# EAGLE schematic lupa-breakout (EAGLE 8.3.1)
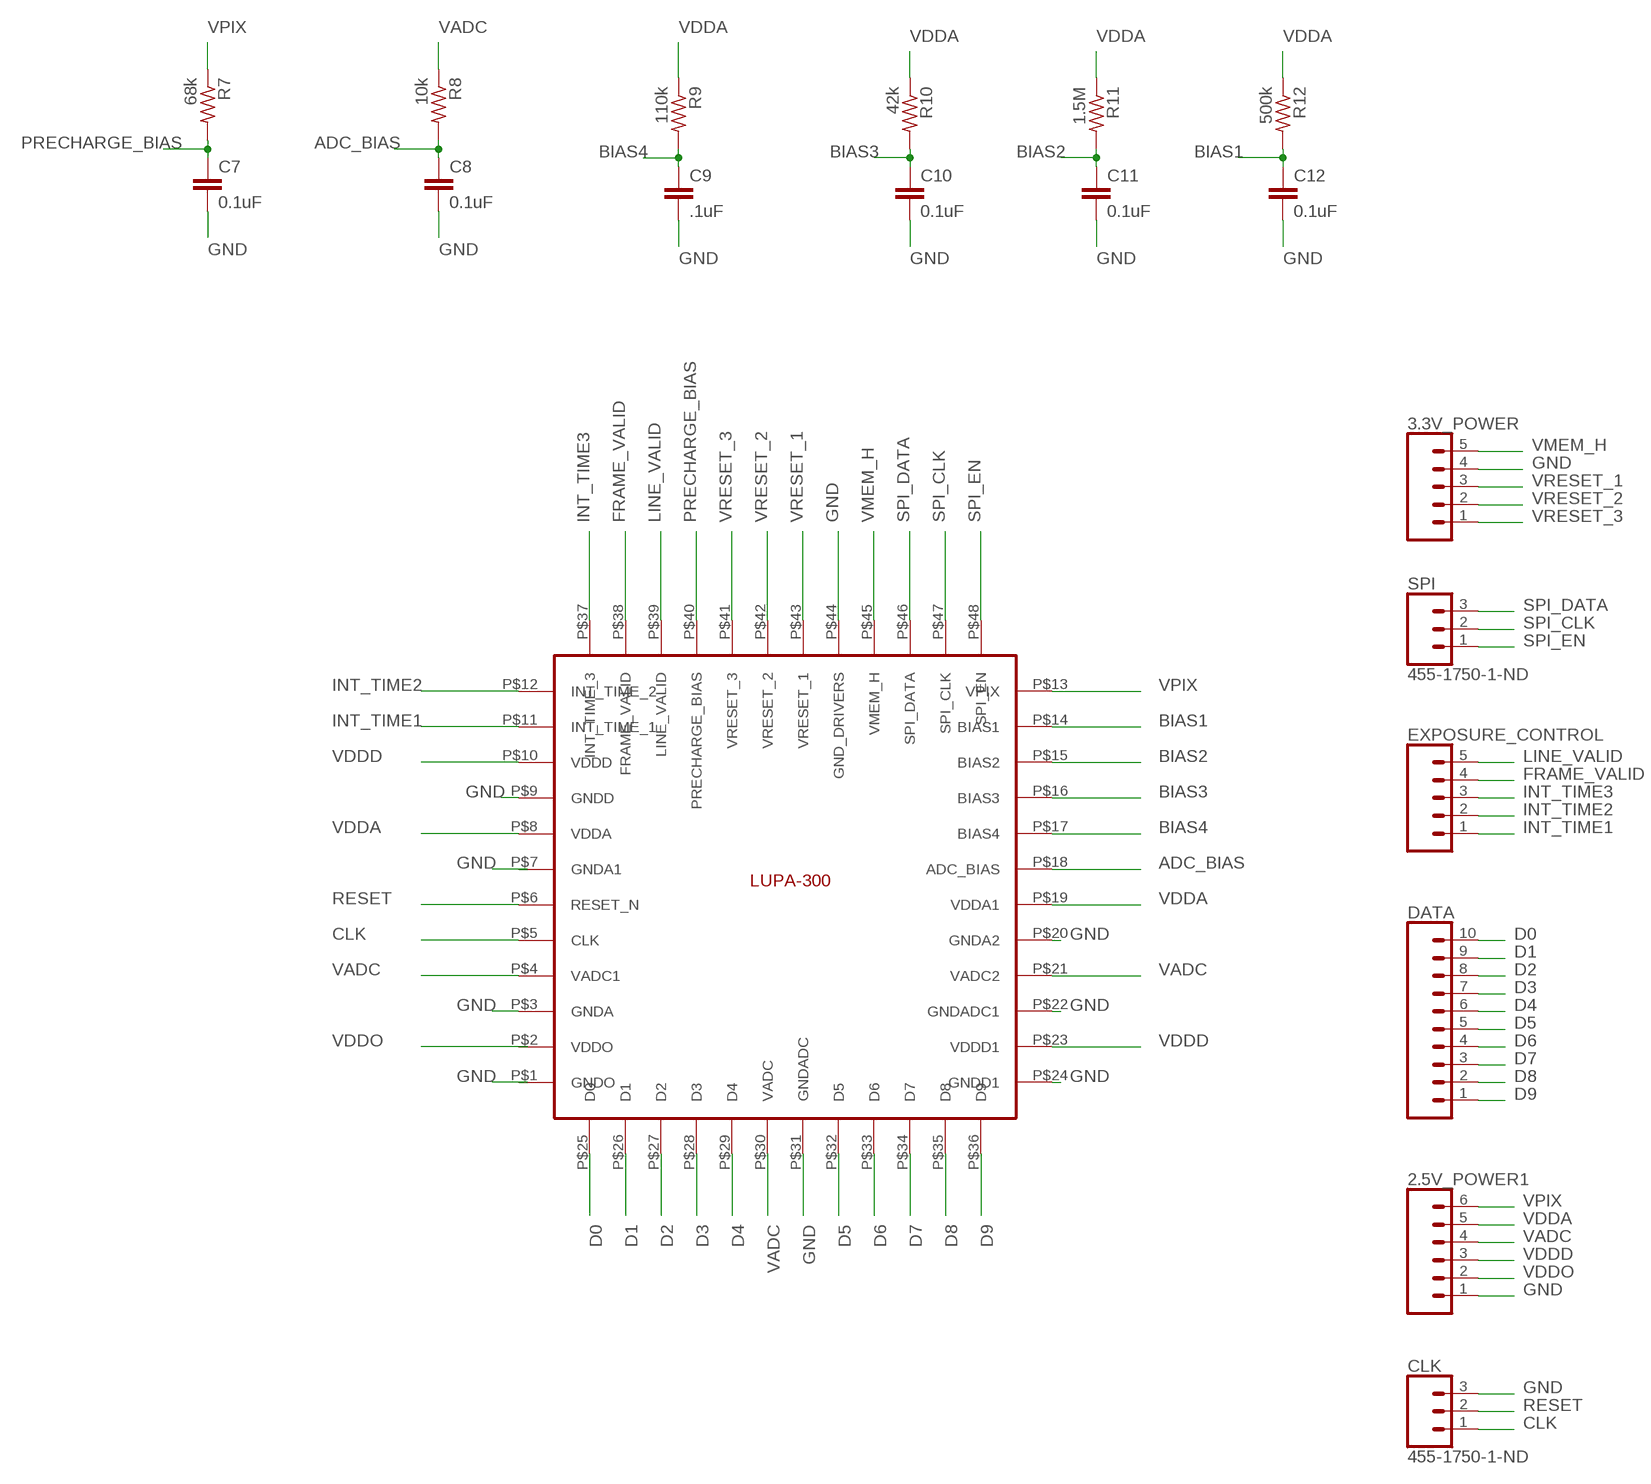
[diagram p0: schematic, sheet 1]

## Parts
2.5V_POWER1  CONN_06SILK_FEMALE_PTH  [1X06]
3.3V_POWER  CONN_05  [1X05]
C7  0.1uF  C-EUC1206  [C1206]
C8  0.1uF  C-EUC1206  [C1206]
C9  .1uF  C-EUC1206  [C1206]
C10  0.1uF  C-EUC1206  [C1206]
C11  0.1uF  C-EUC1206  [C1206]
C12  0.1uF  C-EUC1206  [C1206]
CLK  455-1750-1-ND  CONN_03  [1X03]
DATA  CONN_10"  [1X10]
EXPOSURE_CONTROL  CONN_05  [1X05]
R7  68k  R-US_M1206  [M1206]
R8  10k  R-US_M1206  [M1206]
R9  110k  R-US_M1206  [M1206]
R10  42k  R-US_M1206  [M1206]
R11  1.5M  R-US_M1206  [M1206]
R12  500k  R-US_M1206  [M1206]
SPI  455-1750-1-ND  CONN_03  [1X03]
U$1  LUPA300  [LUPA300]

## Nets
ADC_BIAS: C8.1 R8.2 U$1.P$18(ADC_BIAS)
BIAS1: C12.1 R12.2 U$1.P$14(BIAS1)
BIAS2: C11.1 R11.2 U$1.P$15(BIAS2)
BIAS3: C10.1 R10.2 U$1.P$16(BIAS3)
BIAS4: C9.1 R9.2 U$1.P$17(BIAS4)
CLK: CLK.1 U$1.P$5(CLK)
D0: DATA.10 U$1.P$25(D0)
D1: DATA.9 U$1.P$26(D1)
D2: DATA.8 U$1.P$27(D2)
D3: DATA.7 U$1.P$28(D3)
D4: DATA.6 U$1.P$29(D4)
D5: DATA.5 U$1.P$32(D5)
D6: DATA.4 U$1.P$33(D6)
D7: DATA.3 U$1.P$34(D7)
D8: DATA.2 U$1.P$35(D8)
D9: DATA.1 U$1.P$36(D9)
FRAME_VALID: EXPOSURE_CONTROL.4 U$1.P$38(FRAME_VALID)
GND: 2.5V_POWER1.1 3.3V_POWER.4 C7.2 C8.2 C9.2 C10.2 C11.2 C12.2 CLK.3 U$1.P$1(GNDO) U$1.P$3(GNDA) U$1.P$9(GNDD) U$1.P$20(GNDA2) U$1.P$22(GNDADC1) U$1.P$24(GNDD1) U$1.P$31(GNDADC) U$1.P$44(GND_DRIVERS)
INT_TIME1: EXPOSURE_CONTROL.1 U$1.P$11(INT_TIME_1)
INT_TIME2: EXPOSURE_CONTROL.2 U$1.P$12(INT_TIME_2)
INT_TIME3: EXPOSURE_CONTROL.3 U$1.P$37(INT_TIME_3)
LINE_VALID: EXPOSURE_CONTROL.5 U$1.P$39(LINE_VALID)
PRECHARGE_BIAS: C7.1 R7.2 U$1.P$40(PRECHARGE_BIAS)
RESET: CLK.2 U$1.P$6(RESET_N)
SPI_CLK: SPI.2 U$1.P$47(SPI_CLK)
SPI_DATA: SPI.3 U$1.P$46(SPI_DATA)
SPI_EN: SPI.1 U$1.P$48(SPI_EN)
VADC: 2.5V_POWER1.4 R8.1 U$1.P$4(VADC1) U$1.P$21(VADC2) U$1.P$30(VADC)
VDDA: 2.5V_POWER1.5 R9.1 R10.1 R11.1 R12.1 U$1.P$8(VDDA) U$1.P$19(VDDA1)
VDDD: 2.5V_POWER1.3 U$1.P$10(VDDD) U$1.P$23(VDDD1)
VDDO: 2.5V_POWER1.2 U$1.P$2(VDDO)
VMEM_H: 3.3V_POWER.5 U$1.P$45(VMEM_H)
VPIX: 2.5V_POWER1.6 R7.1 U$1.P$13(VPIX)
VRESET_1: 3.3V_POWER.3 U$1.P$43(VRESET_1)
VRESET_2: 3.3V_POWER.2 U$1.P$42(VRESET_2)
VRESET_3: 3.3V_POWER.1 U$1.P$41(VRESET_3)
Unconnected: U$1.P$7(GNDA1)

## Library data of the parts
2.5V_POWER1 = SparkFun-Connectors:CONN_06: Multi connection point. Often used as Generic Header-pin footprint for 0.1 inch spaced/style header connections On any of the 0.1 inch spaced packages, you can populate with these: Break Away Headers - Straight <https://www.sparkfun.com/products/116> (PRT-00116) Break Away Male Headers - Right Angle <https://www.sparkfun.com/products/553> (PRT-00553) Female Headers <https://www.sparkfun.com/products/115> (PRT-00115) Break Away Headers - Machine Pin <https://www.sparkfun.com/products/117> (PRT-00117) Break Away Female Headers - Swiss Machine Pin <https://www.sparkfun.com/products/743> (PRT-00743) Arduino Stackable Header - 6 Pin <https://www.sparkfun.com/products/9280> (PRT-09280) For SCREWTERMINALS and SPRING TERMINALS visit here: Screw Terimnals on SparkFun.com <https://www.sparkfun.com/search/results?term=Screw+Terminals> (5mm/3.5mm/2.54mm spacing) This device is also useful as a general connection point to wire up your design to another part of your project. Our various solder wires solder well into these plated through hole pads. Hook-Up Wire - Assortment (Stranded, 22 AWG) <https://www.sparkfun.com/products/11375> (PRT-11375) Hook-Up Wire - Assortment (Solid Core, 22 AWG) <https://www.sparkfun.com/products/11367> (PRT-11367) View the entire wire category on our website here <https://www.sparkfun.com/categories/141>; PROD_ID: CONN-08437
3.3V_POWER EXPOSURE_CONTROL = SparkFun-Connectors:CONN_05: Multi connection point. Often used as Generic Header-pin footprint for 0.1 inch spaced/style header connections On any of the 0.1 inch spaced packages, you can populate with these: Break Away Headers - Straight <https://www.sparkfun.com/products/116> (PRT-00116) Break Away Male Headers - Right Angle <https://www.sparkfun.com/products/553> (PRT-00553) Female Headers <https://www.sparkfun.com/products/115> (PRT-00115) Break Away Headers - Machine Pin <https://www.sparkfun.com/products/117> (PRT-00117) Break Away Female Headers - Swiss Machine Pin <https://www.sparkfun.com/products/743> (PRT-00743) For SCREWTERMINALS and SPRING TERMINALS visit here: Screw Terimnals on SparkFun.com <https://www.sparkfun.com/search/results?term=Screw+Terminals> (5mm/3.5mm/2.54mm spacing) This device is also useful as a general connection point to wire up your design to another part of your project. Our various solder wires solder well into these plated through hole pads. Hook-Up Wire - Assortment (Stranded, 22 AWG) <https://www.sparkfun.com/products/11375> (PRT-11375) Hook-Up Wire - Assortment (Solid Core, 22 AWG) <https://www.sparkfun.com/products/11367> (PRT-11367) View the entire wire category on our website here <https://www.sparkfun.com/categories/141> Special notes: Molex polarized connector foot print use with SKU : PRT-08231 with associated crimp pins and housings. 1MM SMD Version SKU: PRT-10208
C7-C12 = rcl:C-EU: CAPACITOR, European symbol
CLK SPI = SparkFun-Connectors:CONN_03: Multi connection point. Often used as Generic Header-pin footprint for 0.1 inch spaced/style header connections On any of the 0.1 inch spaced packages, you can populate with these: Break Away Headers - Straight <https://www.sparkfun.com/products/116> (PRT-00116) Break Away Male Headers - Right Angle <https://www.sparkfun.com/products/553> (PRT-00553) Female Headers <https://www.sparkfun.com/products/115> (PRT-00115) Break Away Headers - Machine Pin <https://www.sparkfun.com/products/117> (PRT-00117) Break Away Female Headers - Swiss Machine Pin <https://www.sparkfun.com/products/743> (PRT-00743) Stackable Header - 3 Pin (Female, 0.1") <https://www.sparkfun.com/products/13875> (PRT-13875) For SCREWTERMINALS and SPRING TERMINALS visit here: Screw Terimnals on SparkFun.com <https://www.sparkfun.com/search/results?term=Screw+Terminals> (5mm/3.5mm/2.54mm spacing) This device is also useful as a general connection point to wire up your design to another part of your project. Our various solder wires solder well into these plated through hole pads. Hook-Up Wire - Assortment (Stranded, 22 AWG) <https://www.sparkfun.com/products/11375> (PRT-11375) Hook-Up Wire - Assortment (Solid Core, 22 AWG) <https://www.sparkfun.com/products/11367> (PRT-11367) View the entire wire category on our website here <https://www.sparkfun.com/categories/141> Special notes: Molex polarized connector foot print use with SKU : PRT-08232 with associated crimp pins and housings.; PROD_ID: XXX-00000
DATA = SparkFun-Connectors:CONN_10: Multi connection point. Often used as Generic Header-pin footprint for 0.1 inch spaced/style header connections On any of the 0.1 inch spaced packages, you can populate with these: Break Away Headers - Straight <https://www.sparkfun.com/products/116> (PRT-00116) Break Away Male Headers - Right Angle <https://www.sparkfun.com/products/553> (PRT-00553) Female Headers <https://www.sparkfun.com/products/115> (PRT-00115) Break Away Headers - Machine Pin <https://www.sparkfun.com/products/117> (PRT-00117) Break Away Female Headers - Swiss Machine Pin <https://www.sparkfun.com/products/743> (PRT-00743) Arduino Stackable Header - 10 Pin <https://www.sparkfun.com/products/11376> (PRT-11376) For SCREWTERMINALS and SPRING TERMINALS visit here: Screw Terimnals on SparkFun.com <https://www.sparkfun.com/search/results?term=Screw+Terminals> (5mm/3.5mm/2.54mm spacing) This device is also useful as a general connection point to wire up your design to another part of your project. Our various solder wires solder well into these plated through hole pads. Hook-Up Wire - Assortment (Stranded, 22 AWG) <https://www.sparkfun.com/products/11375> (PRT-11375) Hook-Up Wire - Assortment (Solid Core, 22 AWG) <https://www.sparkfun.com/products/11367> (PRT-11367) View the entire wire category on our website here <https://www.sparkfun.com/categories/141> Special notes: Molex polarized connector foot print use with SKU : PRT-08231 with associated crimp pins and housings. 1MM SMD Version SKU: PRT-10208 NOTES ON THE VARIANTS LOCK and LOCK_LONGPADS... This footprint was designed to help hold the alignment of a through-hole component (i.e. 6-pin header) while soldering it into place. You may notice that each hole has been shifted either up or down by 0.005 of an inch from it's more standard position (which is a perfectly straight line). This slight alteration caused the pins (the squares in the middle) to touch the edges of the holes. Because they are alternating, it causes a "brace" to hold the component in place. 0.005 has proven to be the perfect amount of "off-center" position when using our standard breakaway headers. Although looks a little odd when you look at the bare footprint, once you have a header in there, the alteration is very hard to notice. Also,if you push a header all the way into place, it is covered up entirely on the bottom side.; PROD_ID: CONN-11563
R7-R12 = resistor:R-US_: RESISTOR, American symbol
U$1 = andon:LUPA300